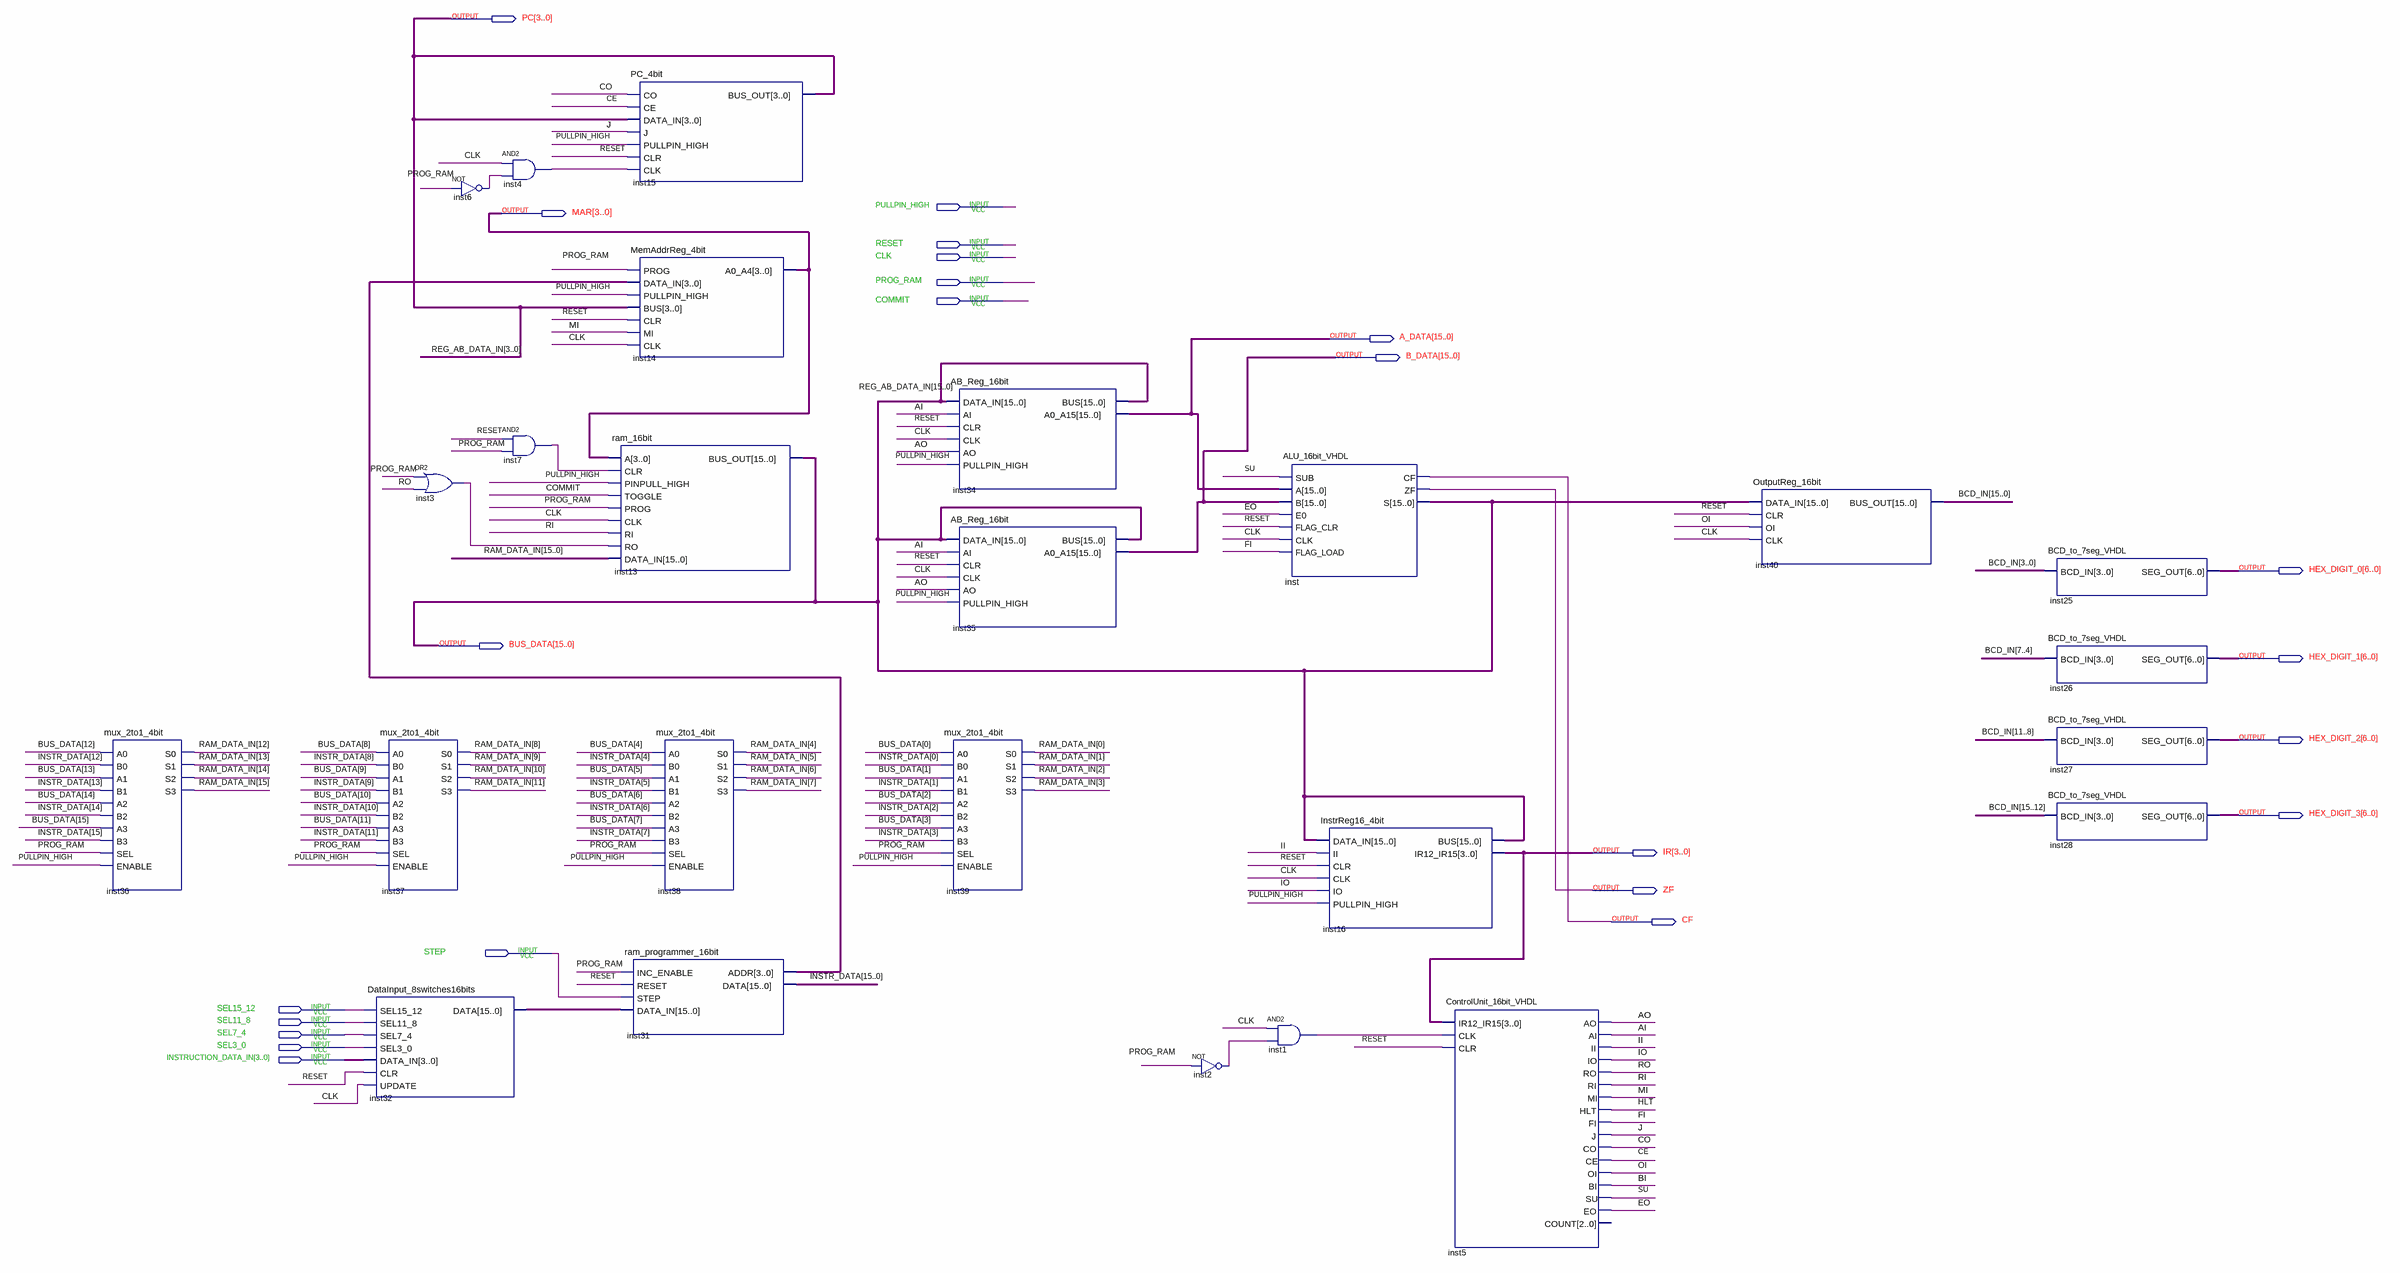
[diagram p0: schematic sheet]
// Quartus schematic CPU.bdf as structural Verilog: 25 symbols, 23 pins
module CPU (
  input  PULLPIN_HIGH,
  input  RESET,
  input  CLK,
  input  PROG_RAM,
  input  COMMIT,
  input  STEP,
  input  SEL15_12,
  input  SEL11_8,
  input  SEL7_4,
  input  SEL3_0,
  input  [3:0] INSTRUCTION_DATA_IN,
  output [3:0] PC,
  output [3:0] MAR,
  output [15:0] A_DATA,
  output [15:0] B_DATA,
  output [6:0] HEX_DIGIT_0,
  output [15:0] BUS_DATA,
  output [6:0] HEX_DIGIT_1,
  output [6:0] HEX_DIGIT_2,
  output [6:0] HEX_DIGIT_3,
  output [3:0] IR,
  output ZF,
  output CF
);

  wire AI, AO, BI, CE, CO, EO, FI, HLT, II, inst1_out, inst2_out, inst3_out, inst4_out, inst6_out, inst7_out,
       IO, J, MI, OI, RI, RO, SU;
  wire [3:0] inst31_addr;
  wire [15:0] BCD_IN, inst32_data, INSTR_DATA, RAM_DATA_IN;

  mux_2to1_4bit inst36 (
    .A0(BUS_DATA[12]), .B0(INSTR_DATA[12]), .A1(BUS_DATA[13]), .B1(INSTR_DATA[13]), .A2(BUS_DATA[14]),
    .B2(INSTR_DATA[14]), .A3(BUS_DATA[15]), .B3(INSTR_DATA[15]), .SEL(PROG_RAM), .ENABLE(PULLPIN_HIGH),
    .S0(RAM_DATA_IN[12]), .S1(RAM_DATA_IN[13]), .S2(RAM_DATA_IN[14]), .S3(RAM_DATA_IN[15]));
  DataInput_8switches16bits inst32 (
    .SEL15_12(SEL15_12), .SEL11_8(SEL11_8), .SEL7_4(SEL7_4), .SEL3_0(SEL3_0), .DATA_IN(INSTRUCTION_DATA_IN),
    .CLR(RESET), .UPDATE(CLK), .DATA(inst32_data));
  or inst3 (inst3_out, PROG_RAM, RO);
  mux_2to1_4bit inst37 (
    .A0(BUS_DATA[8]), .B0(INSTR_DATA[8]), .A1(BUS_DATA[9]), .B1(INSTR_DATA[9]), .A2(BUS_DATA[10]),
    .B2(INSTR_DATA[10]), .A3(BUS_DATA[11]), .B3(INSTR_DATA[11]), .SEL(PROG_RAM), .ENABLE(PULLPIN_HIGH),
    .S0(RAM_DATA_IN[8]), .S1(RAM_DATA_IN[9]), .S2(RAM_DATA_IN[10]), .S3(RAM_DATA_IN[11]));
  not inst6 (inst6_out, PROG_RAM);
  and inst4 (inst4_out, CLK, inst6_out);
  and inst7 (inst7_out, RESET, PROG_RAM);
  ram_16bit inst13 (
    .A(MAR), .CLR(inst7_out), .PINPULL_HIGH(PULLPIN_HIGH), .TOGGLE(COMMIT), .PROG(PROG_RAM), .CLK(CLK),
    .RI(RI), .RO(inst3_out), .DATA_IN(RAM_DATA_IN), .BUS_OUT(BUS_DATA));
  ram_programmer_16bit inst31 (
    .INC_ENABLE(PROG_RAM), .RESET(RESET), .STEP(STEP), .DATA_IN(inst32_data), .ADDR(inst31_addr),
    .DATA(INSTR_DATA));
  PC_4bit inst15 (
    .CO(CO), .CE(CE), .DATA_IN(BUS_DATA[3:0]), .J(J), .PULLPIN_HIGH(PULLPIN_HIGH), .CLR(RESET),
    .CLK(inst4_out), .BUS_OUT(BUS_DATA[3:0]));
  MemAddrReg_4bit inst14 (
    .PROG(PROG_RAM), .DATA_IN(inst31_addr), .PULLPIN_HIGH(PULLPIN_HIGH), .BUS(BUS_DATA[3:0]), .CLR(RESET),
    .MI(MI), .CLK(CLK), .A0_A4(MAR));
  mux_2to1_4bit inst38 (
    .A0(BUS_DATA[4]), .B0(INSTR_DATA[4]), .A1(BUS_DATA[5]), .B1(INSTR_DATA[5]), .A2(BUS_DATA[6]),
    .B2(INSTR_DATA[6]), .A3(BUS_DATA[7]), .B3(INSTR_DATA[7]), .SEL(PROG_RAM), .ENABLE(PULLPIN_HIGH),
    .S0(RAM_DATA_IN[4]), .S1(RAM_DATA_IN[5]), .S2(RAM_DATA_IN[6]), .S3(RAM_DATA_IN[7]));
  AB_Reg_16bit inst34 (
    .DATA_IN(BUS_DATA), .AI(AI), .CLR(RESET), .CLK(CLK), .AO(AO), .PULLPIN_HIGH(PULLPIN_HIGH),
    .BUS(BUS_DATA), .A0_A15(A_DATA));
  AB_Reg_16bit inst35 (
    .DATA_IN(BUS_DATA), .AI(AI), .CLR(RESET), .CLK(CLK), .AO(AO), .PULLPIN_HIGH(PULLPIN_HIGH),
    .BUS(BUS_DATA), .A0_A15(B_DATA));
  mux_2to1_4bit inst39 (
    .A0(BUS_DATA[0]), .B0(INSTR_DATA[0]), .A1(BUS_DATA[1]), .B1(INSTR_DATA[1]), .A2(BUS_DATA[2]),
    .B2(INSTR_DATA[2]), .A3(BUS_DATA[3]), .B3(INSTR_DATA[3]), .SEL(PROG_RAM), .ENABLE(PULLPIN_HIGH),
    .S0(RAM_DATA_IN[0]), .S1(RAM_DATA_IN[1]), .S2(RAM_DATA_IN[2]), .S3(RAM_DATA_IN[3]));
  not inst2 (inst2_out, PROG_RAM);
  and inst1 (inst1_out, CLK, inst2_out);
  ALU_16bit_VHDL inst (
    .SUB(SU), .A(A_DATA), .B(B_DATA), .E0(EO), .FLAG_CLR(RESET), .CLK(CLK), .FLAG_LOAD(FI), .CF(CF), .ZF(ZF),
    .S(BUS_DATA));
  InstrReg16_4bit inst16 (
    .DATA_IN(BUS_DATA), .II(II), .CLR(RESET), .CLK(CLK), .IO(IO), .PULLPIN_HIGH(PULLPIN_HIGH),
    .BUS(BUS_DATA), .IR12_IR15(IR));
  ControlUnit_16bit_VHDL inst5 (
    .IR12_IR15(IR), .CLK(inst1_out), .CLR(RESET), .AO(AO), .AI(AI), .II(II), .IO(IO), .RO(RO), .RI(RI),
    .MI(MI), .HLT(HLT), .FI(FI), .J(J), .CO(CO), .CE(CE), .OI(OI), .BI(BI), .SU(SU), .EO(EO));  // open: COUNT
  OutputReg_16bit inst40 (.DATA_IN(BUS_DATA), .CLR(RESET), .OI(OI), .CLK(CLK), .BUS_OUT(BCD_IN));
  BCD_to_7seg_VHDL inst25 (.BCD_IN(BCD_IN[3:0]), .SEG_OUT(HEX_DIGIT_0));
  BCD_to_7seg_VHDL inst26 (.BCD_IN(BCD_IN[7:4]), .SEG_OUT(HEX_DIGIT_1));
  BCD_to_7seg_VHDL inst27 (.BCD_IN(BCD_IN[11:8]), .SEG_OUT(HEX_DIGIT_2));
  BCD_to_7seg_VHDL inst28 (.BCD_IN(BCD_IN[15:12]), .SEG_OUT(HEX_DIGIT_3));

  assign PC = BUS_DATA[3:0];

  // Other names for the same wires on the sheet: REG_AB_DATA_IN[15:0] = BUS_DATA
endmodule
